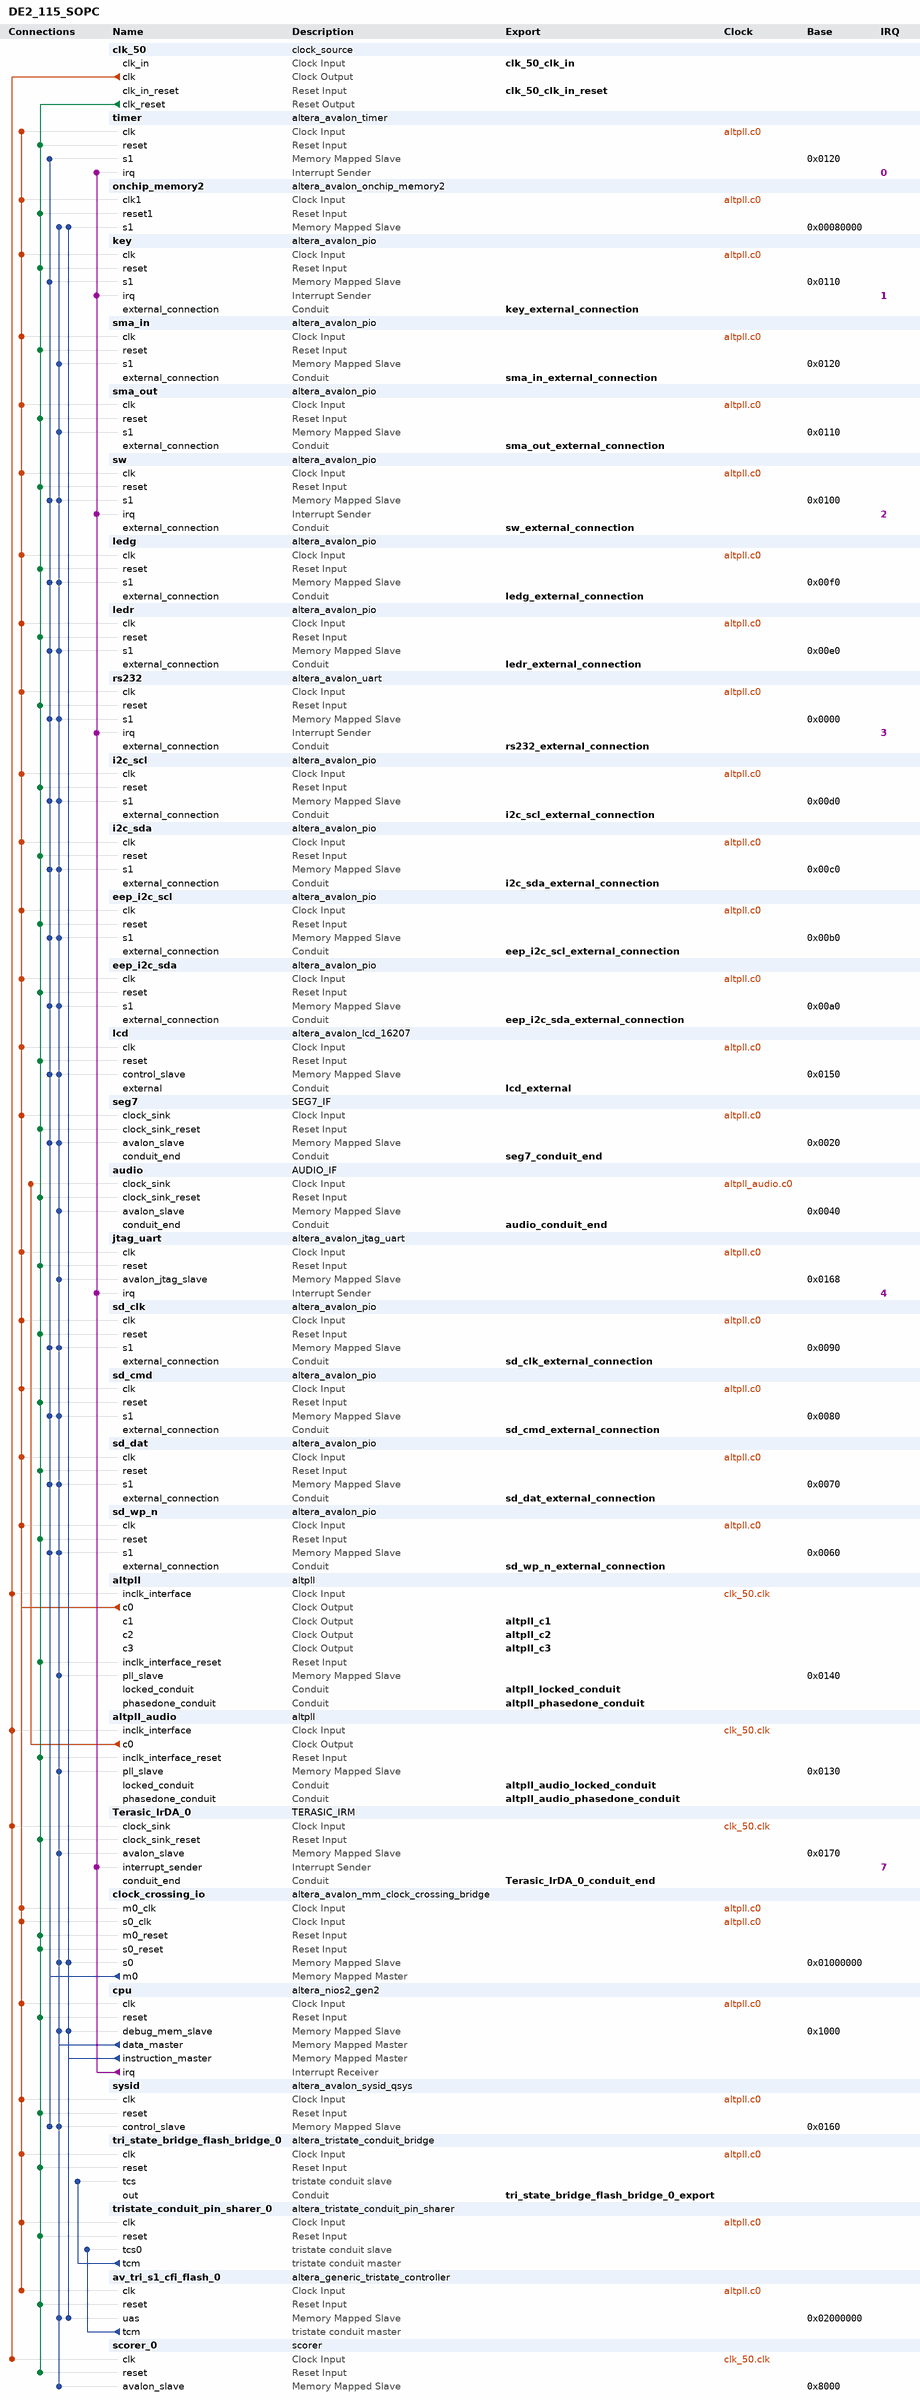
[diagram p0: system contents]
# Platform Designer (Qsys) system DE2_115_SOPC, Cyclone IV E EP4CE115F29C7
# Parameters at their usual value, and those the tool derives, are not listed.
package require -exact qsys 15.0
create_system DE2_115_SOPC
set_project_property DEVICE_FAMILY {Cyclone IV E}
set_project_property DEVICE EP4CE115F29C7

add_instance clk_50 clock_source 15.0
set_instance_parameter_value clk_50 clockFrequency 50000000

add_instance timer altera_avalon_timer 15.0
set_instance_parameter_value timer period 1
set_instance_parameter_value timer periodUnits MSEC

add_instance onchip_memory2 altera_avalon_onchip_memory2 15.0
set_instance_parameter_value onchip_memory2 dataWidth 32
set_instance_parameter_value onchip_memory2 dualPort false
set_instance_parameter_value onchip_memory2 initMemContent true
set_instance_parameter_value onchip_memory2 initializationFileName onchip_memory2
set_instance_parameter_value onchip_memory2 memorySize 262144

add_instance key altera_avalon_pio 15.0
set_instance_parameter_value key captureEdge true
set_instance_parameter_value key direction Input
set_instance_parameter_value key edgeType FALLING
set_instance_parameter_value key generateIRQ true
set_instance_parameter_value key irqType EDGE
set_instance_parameter_value key width 4

add_instance sma_in altera_avalon_pio 15.0
set_instance_parameter_value sma_in direction Input
set_instance_parameter_value sma_in width 1

add_instance sma_out altera_avalon_pio 15.0
set_instance_parameter_value sma_out direction Output
set_instance_parameter_value sma_out width 1

add_instance sw altera_avalon_pio 15.0
set_instance_parameter_value sw captureEdge true
set_instance_parameter_value sw direction Input
set_instance_parameter_value sw edgeType FALLING
set_instance_parameter_value sw generateIRQ true
set_instance_parameter_value sw irqType EDGE
set_instance_parameter_value sw width 18

add_instance ledg altera_avalon_pio 15.0
set_instance_parameter_value ledg direction Output
set_instance_parameter_value ledg width 9

add_instance ledr altera_avalon_pio 15.0
set_instance_parameter_value ledr direction Output
set_instance_parameter_value ledr width 18

add_instance rs232 altera_avalon_uart 15.0
set_instance_parameter_value rs232 baud 115200
set_instance_parameter_value rs232 dataBits 8
set_instance_parameter_value rs232 fixedBaud true
set_instance_parameter_value rs232 parity NONE
set_instance_parameter_value rs232 stopBits 1
set_instance_parameter_value rs232 useCtsRts true

add_instance i2c_scl altera_avalon_pio 15.0
set_instance_parameter_value i2c_scl direction Output
set_instance_parameter_value i2c_scl width 1

add_instance i2c_sda altera_avalon_pio 15.0
set_instance_parameter_value i2c_sda direction Bidir
set_instance_parameter_value i2c_sda width 1

add_instance eep_i2c_scl altera_avalon_pio 15.0
set_instance_parameter_value eep_i2c_scl direction Output
set_instance_parameter_value eep_i2c_scl width 1

add_instance eep_i2c_sda altera_avalon_pio 15.0
set_instance_parameter_value eep_i2c_sda direction Bidir
set_instance_parameter_value eep_i2c_sda width 1

add_instance lcd altera_avalon_lcd_16207 15.0

add_instance seg7 SEG7_IF 1.0
set_instance_parameter_value seg7 SEG7_NUM 8

add_instance audio AUDIO_IF 1.0

add_instance jtag_uart altera_avalon_jtag_uart 15.0
set_instance_parameter_value jtag_uart simInteractiveOptions INTERACTIVE_ASCII_OUTPUT

add_instance sd_clk altera_avalon_pio 15.0
set_instance_parameter_value sd_clk direction Output
set_instance_parameter_value sd_clk width 1

add_instance sd_cmd altera_avalon_pio 15.0
set_instance_parameter_value sd_cmd direction Bidir
set_instance_parameter_value sd_cmd width 1

add_instance sd_dat altera_avalon_pio 15.0
set_instance_parameter_value sd_dat direction Bidir
set_instance_parameter_value sd_dat width 4

add_instance sd_wp_n altera_avalon_pio 15.0
set_instance_parameter_value sd_wp_n direction Input
set_instance_parameter_value sd_wp_n width 1

add_instance altpll altpll 15.0
set_instance_parameter_value altpll CLK0_DIVIDE_BY 1
set_instance_parameter_value altpll CLK0_MULTIPLY_BY 2
set_instance_parameter_value altpll CLK1_DIVIDE_BY 1
set_instance_parameter_value altpll CLK1_DUTY_CYCLE 50
set_instance_parameter_value altpll CLK1_MULTIPLY_BY 2
set_instance_parameter_value altpll CLK1_PHASE_SHIFT -1806
set_instance_parameter_value altpll CLK2_DIVIDE_BY 5
set_instance_parameter_value altpll CLK2_DUTY_CYCLE 50
set_instance_parameter_value altpll CLK2_MULTIPLY_BY 1
set_instance_parameter_value altpll CLK2_PHASE_SHIFT 0
set_instance_parameter_value altpll CLK3_DIVIDE_BY 2
set_instance_parameter_value altpll CLK3_DUTY_CYCLE 50
set_instance_parameter_value altpll CLK3_MULTIPLY_BY 1
set_instance_parameter_value altpll CLK3_PHASE_SHIFT 0
set_instance_parameter_value altpll INCLK0_INPUT_FREQUENCY 20000
set_instance_parameter_value altpll PORT_ARESET PORT_USED
set_instance_parameter_value altpll PORT_LOCKED PORT_USED
set_instance_parameter_value altpll PORT_clk1 PORT_USED
set_instance_parameter_value altpll PORT_clk2 PORT_USED
set_instance_parameter_value altpll PORT_clk3 PORT_USED

add_instance altpll_audio altpll 15.0
set_instance_parameter_value altpll_audio CLK0_DIVIDE_BY 3125
set_instance_parameter_value altpll_audio CLK0_MULTIPLY_BY 1152
set_instance_parameter_value altpll_audio INCLK0_INPUT_FREQUENCY 20000
set_instance_parameter_value altpll_audio PORT_ARESET PORT_USED
set_instance_parameter_value altpll_audio PORT_LOCKED PORT_UNUSED
set_instance_parameter_value altpll_audio PORT_clk1 PORT_UNUSED
set_instance_parameter_value altpll_audio PORT_clk2 PORT_UNUSED
set_instance_parameter_value altpll_audio PORT_clk3 PORT_UNUSED

add_instance Terasic_IrDA_0 TERASIC_IRM 1.0

add_instance clock_crossing_io altera_avalon_mm_clock_crossing_bridge 15.0
set_instance_parameter_value clock_crossing_io ADDRESS_WIDTH 9
set_instance_parameter_value clock_crossing_io COMMAND_FIFO_DEPTH 32
set_instance_parameter_value clock_crossing_io DATA_WIDTH 32
set_instance_parameter_value clock_crossing_io MASTER_SYNC_DEPTH 3
set_instance_parameter_value clock_crossing_io MAX_BURST_SIZE 1
set_instance_parameter_value clock_crossing_io RESPONSE_FIFO_DEPTH 256
set_instance_parameter_value clock_crossing_io SLAVE_SYNC_DEPTH 3
set_instance_parameter_value clock_crossing_io USE_AUTO_ADDRESS_WIDTH 0

add_instance cpu altera_nios2_gen2 15.0
set_instance_parameter_value cpu dcache_size 2048
set_instance_parameter_value cpu exceptionSlave onchip_memory2.s1
set_instance_parameter_value cpu icache_size 4096
set_instance_parameter_value cpu impl Fast
set_instance_parameter_value cpu resetSlave onchip_memory2.s1
set_instance_parameter_value cpu setting_activateTrace true

add_instance sysid altera_avalon_sysid_qsys 15.0
set_instance_parameter_value sysid id 0

add_instance tri_state_bridge_flash_bridge_0 altera_tristate_conduit_bridge 15.0

add_instance tristate_conduit_pin_sharer_0 altera_tristate_conduit_pin_sharer 15.0
set_instance_parameter_value tristate_conduit_pin_sharer_0 NUM_INTERFACES 1

add_instance av_tri_s1_cfi_flash_0 altera_generic_tristate_controller 15.0
set_instance_parameter_value av_tri_s1_cfi_flash_0 ACTIVE_LOW_BEGINTRANSFER 0
set_instance_parameter_value av_tri_s1_cfi_flash_0 ACTIVE_LOW_BYTEENABLE 0
set_instance_parameter_value av_tri_s1_cfi_flash_0 ACTIVE_LOW_OUTPUTENABLE 0
set_instance_parameter_value av_tri_s1_cfi_flash_0 ACTIVE_LOW_READ 1
set_instance_parameter_value av_tri_s1_cfi_flash_0 CHIPSELECT_THROUGH_READLATENCY 0
set_instance_parameter_value av_tri_s1_cfi_flash_0 INTERFACE_ASSIGNMENT_KEYS embeddedsw.configuration.isFlash,embeddedsw.configuration.isMemoryDevice,embeddedsw.configuration.isNonVolatileStorage
set_instance_parameter_value av_tri_s1_cfi_flash_0 INTERFACE_ASSIGNMENT_VALUES 1,1,1
set_instance_parameter_value av_tri_s1_cfi_flash_0 MODULE_ASSIGNMENT_KEYS embeddedsw.configuration.softwareDriver,embeddedsw.CMacro.SETUP_VALUE,embeddedsw.CMacro.WAIT_VALUE,embeddedsw.CMacro.HOLD_VALUE,embeddedsw.CMacro.TIMING_UNITS,embeddedsw.CMacro.SIZE,embeddedsw.memoryInfo.MEM_INIT_DATA_WIDTH,embeddedsw.memoryInfo.HAS_BYTE_LANE,embeddedsw.memoryInfo.IS_FLASH,embeddedsw.memoryInfo.GENERATE_DAT_SYM,embeddedsw.memoryInfo.GENERATE_FLASH,embeddedsw.memoryInfo.DAT_SYM_INSTALL_DIR,embeddedsw.memoryInfo.FLASH_INSTALL_DIR
set_instance_parameter_value av_tri_s1_cfi_flash_0 MODULE_ASSIGNMENT_VALUES {altera_avalon_cfi_flash_driver,60,160,60,"ns",8388608u,8,0,1,1,1,SIM_DIR,APP_DIR}
set_instance_parameter_value av_tri_s1_cfi_flash_0 TCM_ADDRESS_W 23
set_instance_parameter_value av_tri_s1_cfi_flash_0 TCM_BYTEENABLE_W 1
set_instance_parameter_value av_tri_s1_cfi_flash_0 TCM_DATA_HOLD 60
set_instance_parameter_value av_tri_s1_cfi_flash_0 TCM_DATA_W 8
set_instance_parameter_value av_tri_s1_cfi_flash_0 TCM_MAX_PENDING_READ_TRANSACTIONS 3
set_instance_parameter_value av_tri_s1_cfi_flash_0 TCM_READLATENCY 2
set_instance_parameter_value av_tri_s1_cfi_flash_0 TCM_READ_WAIT 160
set_instance_parameter_value av_tri_s1_cfi_flash_0 TCM_SETUP_WAIT 60
set_instance_parameter_value av_tri_s1_cfi_flash_0 TCM_SYMBOLS_PER_WORD 1
set_instance_parameter_value av_tri_s1_cfi_flash_0 TCM_TIMING_UNITS 0
set_instance_parameter_value av_tri_s1_cfi_flash_0 TCM_TURNAROUND_TIME 2
set_instance_parameter_value av_tri_s1_cfi_flash_0 TCM_WRITE_WAIT 160
set_instance_parameter_value av_tri_s1_cfi_flash_0 USE_BEGINTRANSFER 0
set_instance_parameter_value av_tri_s1_cfi_flash_0 USE_BYTEENABLE 0
set_instance_parameter_value av_tri_s1_cfi_flash_0 USE_OUTPUTENABLE 0
set_instance_parameter_value av_tri_s1_cfi_flash_0 USE_READ 1

add_instance scorer_0 scorer 1.0

# connections
add_connection altpll.c0 av_tri_s1_cfi_flash_0.clk clock
add_connection altpll.c0 clock_crossing_io.m0_clk clock
add_connection altpll.c0 clock_crossing_io.s0_clk clock
add_connection altpll.c0 cpu.clk clock
add_connection altpll.c0 eep_i2c_scl.clk clock
add_connection altpll.c0 eep_i2c_sda.clk clock
add_connection altpll.c0 i2c_scl.clk clock
add_connection altpll.c0 i2c_sda.clk clock
add_connection altpll.c0 jtag_uart.clk clock
add_connection altpll.c0 key.clk clock
add_connection altpll.c0 lcd.clk clock
add_connection altpll.c0 ledg.clk clock
add_connection altpll.c0 ledr.clk clock
add_connection altpll.c0 onchip_memory2.clk1 clock
add_connection altpll.c0 rs232.clk clock
add_connection altpll.c0 sd_clk.clk clock
add_connection altpll.c0 sd_cmd.clk clock
add_connection altpll.c0 sd_dat.clk clock
add_connection altpll.c0 sd_wp_n.clk clock
add_connection altpll.c0 seg7.clock_sink clock
add_connection altpll.c0 sma_in.clk clock
add_connection altpll.c0 sma_out.clk clock
add_connection altpll.c0 sw.clk clock
add_connection altpll.c0 sysid.clk clock
add_connection altpll.c0 timer.clk clock
add_connection altpll.c0 tri_state_bridge_flash_bridge_0.clk clock
add_connection altpll.c0 tristate_conduit_pin_sharer_0.clk clock
add_connection altpll_audio.c0 audio.clock_sink clock
add_connection clk_50.clk altpll.inclk_interface clock
add_connection clk_50.clk altpll_audio.inclk_interface clock
add_connection clk_50.clk scorer_0.clk clock
add_connection clk_50.clk Terasic_IrDA_0.clock_sink clock
add_connection clk_50.clk_reset altpll.inclk_interface_reset reset
add_connection clk_50.clk_reset altpll_audio.inclk_interface_reset reset
add_connection clk_50.clk_reset audio.clock_sink_reset reset
add_connection clk_50.clk_reset av_tri_s1_cfi_flash_0.reset reset
add_connection clk_50.clk_reset clock_crossing_io.m0_reset reset
add_connection clk_50.clk_reset clock_crossing_io.s0_reset reset
add_connection clk_50.clk_reset cpu.reset reset
add_connection clk_50.clk_reset eep_i2c_scl.reset reset
add_connection clk_50.clk_reset eep_i2c_sda.reset reset
add_connection clk_50.clk_reset i2c_scl.reset reset
add_connection clk_50.clk_reset i2c_sda.reset reset
add_connection clk_50.clk_reset jtag_uart.reset reset
add_connection clk_50.clk_reset key.reset reset
add_connection clk_50.clk_reset lcd.reset reset
add_connection clk_50.clk_reset ledg.reset reset
add_connection clk_50.clk_reset ledr.reset reset
add_connection clk_50.clk_reset onchip_memory2.reset1 reset
add_connection clk_50.clk_reset rs232.reset reset
add_connection clk_50.clk_reset scorer_0.reset reset
add_connection clk_50.clk_reset sd_clk.reset reset
add_connection clk_50.clk_reset sd_cmd.reset reset
add_connection clk_50.clk_reset sd_dat.reset reset
add_connection clk_50.clk_reset sd_wp_n.reset reset
add_connection clk_50.clk_reset seg7.clock_sink_reset reset
add_connection clk_50.clk_reset sma_in.reset reset
add_connection clk_50.clk_reset sma_out.reset reset
add_connection clk_50.clk_reset sw.reset reset
add_connection clk_50.clk_reset sysid.reset reset
add_connection clk_50.clk_reset Terasic_IrDA_0.clock_sink_reset reset
add_connection clk_50.clk_reset timer.reset reset
add_connection clk_50.clk_reset tri_state_bridge_flash_bridge_0.reset reset
add_connection clk_50.clk_reset tristate_conduit_pin_sharer_0.reset reset
add_connection clock_crossing_io.m0 eep_i2c_scl.s1 avalon
set_connection_parameter_value clock_crossing_io.m0/eep_i2c_scl.s1 baseAddress 0x00b0
add_connection clock_crossing_io.m0 eep_i2c_sda.s1 avalon
set_connection_parameter_value clock_crossing_io.m0/eep_i2c_sda.s1 baseAddress 0x00a0
add_connection clock_crossing_io.m0 i2c_scl.s1 avalon
set_connection_parameter_value clock_crossing_io.m0/i2c_scl.s1 baseAddress 0x00d0
add_connection clock_crossing_io.m0 i2c_sda.s1 avalon
set_connection_parameter_value clock_crossing_io.m0/i2c_sda.s1 baseAddress 0x00c0
add_connection clock_crossing_io.m0 key.s1 avalon
set_connection_parameter_value clock_crossing_io.m0/key.s1 baseAddress 0x0110
add_connection clock_crossing_io.m0 lcd.control_slave avalon
set_connection_parameter_value clock_crossing_io.m0/lcd.control_slave baseAddress 0x0150
add_connection clock_crossing_io.m0 ledg.s1 avalon
set_connection_parameter_value clock_crossing_io.m0/ledg.s1 baseAddress 0x00f0
add_connection clock_crossing_io.m0 ledr.s1 avalon
set_connection_parameter_value clock_crossing_io.m0/ledr.s1 baseAddress 0x00e0
add_connection clock_crossing_io.m0 rs232.s1 avalon
set_connection_parameter_value clock_crossing_io.m0/rs232.s1 baseAddress 0x0000
add_connection clock_crossing_io.m0 sd_clk.s1 avalon
set_connection_parameter_value clock_crossing_io.m0/sd_clk.s1 baseAddress 0x0090
add_connection clock_crossing_io.m0 sd_cmd.s1 avalon
set_connection_parameter_value clock_crossing_io.m0/sd_cmd.s1 baseAddress 0x0080
add_connection clock_crossing_io.m0 sd_dat.s1 avalon
set_connection_parameter_value clock_crossing_io.m0/sd_dat.s1 baseAddress 0x0070
add_connection clock_crossing_io.m0 sd_wp_n.s1 avalon
set_connection_parameter_value clock_crossing_io.m0/sd_wp_n.s1 baseAddress 0x0060
add_connection clock_crossing_io.m0 seg7.avalon_slave avalon
set_connection_parameter_value clock_crossing_io.m0/seg7.avalon_slave baseAddress 0x0020
add_connection clock_crossing_io.m0 sw.s1 avalon
set_connection_parameter_value clock_crossing_io.m0/sw.s1 baseAddress 0x0100
add_connection clock_crossing_io.m0 sysid.control_slave avalon
set_connection_parameter_value clock_crossing_io.m0/sysid.control_slave baseAddress 0x0160
add_connection clock_crossing_io.m0 timer.s1 avalon
set_connection_parameter_value clock_crossing_io.m0/timer.s1 baseAddress 0x0120
add_connection cpu.data_master altpll.pll_slave avalon
set_connection_parameter_value cpu.data_master/altpll.pll_slave baseAddress 0x0140
add_connection cpu.data_master altpll_audio.pll_slave avalon
set_connection_parameter_value cpu.data_master/altpll_audio.pll_slave baseAddress 0x0130
add_connection cpu.data_master audio.avalon_slave avalon
set_connection_parameter_value cpu.data_master/audio.avalon_slave baseAddress 0x0040
add_connection cpu.data_master av_tri_s1_cfi_flash_0.uas avalon
set_connection_parameter_value cpu.data_master/av_tri_s1_cfi_flash_0.uas baseAddress 0x02000000
add_connection cpu.data_master clock_crossing_io.s0 avalon
set_connection_parameter_value cpu.data_master/clock_crossing_io.s0 baseAddress 0x01000000
add_connection cpu.data_master cpu.debug_mem_slave avalon
set_connection_parameter_value cpu.data_master/cpu.debug_mem_slave baseAddress 0x1000
add_connection cpu.data_master eep_i2c_scl.s1 avalon
set_connection_parameter_value cpu.data_master/eep_i2c_scl.s1 baseAddress 0x00b0
add_connection cpu.data_master eep_i2c_sda.s1 avalon
set_connection_parameter_value cpu.data_master/eep_i2c_sda.s1 baseAddress 0x00a0
add_connection cpu.data_master i2c_scl.s1 avalon
set_connection_parameter_value cpu.data_master/i2c_scl.s1 baseAddress 0x00d0
add_connection cpu.data_master i2c_sda.s1 avalon
set_connection_parameter_value cpu.data_master/i2c_sda.s1 baseAddress 0x00c0
add_connection cpu.data_master jtag_uart.avalon_jtag_slave avalon
set_connection_parameter_value cpu.data_master/jtag_uart.avalon_jtag_slave baseAddress 0x0168
add_connection cpu.data_master lcd.control_slave avalon
set_connection_parameter_value cpu.data_master/lcd.control_slave baseAddress 0x0150
add_connection cpu.data_master ledg.s1 avalon
set_connection_parameter_value cpu.data_master/ledg.s1 baseAddress 0x00f0
add_connection cpu.data_master ledr.s1 avalon
set_connection_parameter_value cpu.data_master/ledr.s1 baseAddress 0x00e0
add_connection cpu.data_master onchip_memory2.s1 avalon
set_connection_parameter_value cpu.data_master/onchip_memory2.s1 baseAddress 0x00080000
add_connection cpu.data_master rs232.s1 avalon
set_connection_parameter_value cpu.data_master/rs232.s1 baseAddress 0x0000
add_connection cpu.data_master scorer_0.avalon_slave avalon
set_connection_parameter_value cpu.data_master/scorer_0.avalon_slave baseAddress 0x8000
add_connection cpu.data_master sd_clk.s1 avalon
set_connection_parameter_value cpu.data_master/sd_clk.s1 baseAddress 0x0090
add_connection cpu.data_master sd_cmd.s1 avalon
set_connection_parameter_value cpu.data_master/sd_cmd.s1 baseAddress 0x0080
add_connection cpu.data_master sd_dat.s1 avalon
set_connection_parameter_value cpu.data_master/sd_dat.s1 baseAddress 0x0070
add_connection cpu.data_master sd_wp_n.s1 avalon
set_connection_parameter_value cpu.data_master/sd_wp_n.s1 baseAddress 0x0060
add_connection cpu.data_master seg7.avalon_slave avalon
set_connection_parameter_value cpu.data_master/seg7.avalon_slave baseAddress 0x0020
add_connection cpu.data_master sma_in.s1 avalon
set_connection_parameter_value cpu.data_master/sma_in.s1 baseAddress 0x0120
add_connection cpu.data_master sma_out.s1 avalon
set_connection_parameter_value cpu.data_master/sma_out.s1 baseAddress 0x0110
add_connection cpu.data_master sw.s1 avalon
set_connection_parameter_value cpu.data_master/sw.s1 baseAddress 0x0100
add_connection cpu.data_master sysid.control_slave avalon
set_connection_parameter_value cpu.data_master/sysid.control_slave baseAddress 0x0160
add_connection cpu.data_master Terasic_IrDA_0.avalon_slave avalon
set_connection_parameter_value cpu.data_master/Terasic_IrDA_0.avalon_slave baseAddress 0x0170
add_connection cpu.instruction_master av_tri_s1_cfi_flash_0.uas avalon
set_connection_parameter_value cpu.instruction_master/av_tri_s1_cfi_flash_0.uas baseAddress 0x02000000
add_connection cpu.instruction_master clock_crossing_io.s0 avalon
set_connection_parameter_value cpu.instruction_master/clock_crossing_io.s0 baseAddress 0x01000000
add_connection cpu.instruction_master cpu.debug_mem_slave avalon
set_connection_parameter_value cpu.instruction_master/cpu.debug_mem_slave baseAddress 0x1000
add_connection cpu.instruction_master onchip_memory2.s1 avalon
set_connection_parameter_value cpu.instruction_master/onchip_memory2.s1 baseAddress 0x00080000
add_connection cpu.irq jtag_uart.irq interrupt
set_connection_parameter_value cpu.irq/jtag_uart.irq irqNumber 4
add_connection cpu.irq key.irq interrupt
set_connection_parameter_value cpu.irq/key.irq irqNumber 1
add_connection cpu.irq rs232.irq interrupt
set_connection_parameter_value cpu.irq/rs232.irq irqNumber 3
add_connection cpu.irq sw.irq interrupt
set_connection_parameter_value cpu.irq/sw.irq irqNumber 2
add_connection cpu.irq Terasic_IrDA_0.interrupt_sender interrupt
set_connection_parameter_value cpu.irq/Terasic_IrDA_0.interrupt_sender irqNumber 7
add_connection cpu.irq timer.irq interrupt
set_connection_parameter_value cpu.irq/timer.irq irqNumber 0
add_connection av_tri_s1_cfi_flash_0.tcm tristate_conduit_pin_sharer_0.tcs0 tristate_conduit
add_connection tristate_conduit_pin_sharer_0.tcm tri_state_bridge_flash_bridge_0.tcs tristate_conduit

# exported interfaces
add_interface Terasic_IrDA_0_conduit_end conduit end
set_interface_property Terasic_IrDA_0_conduit_end EXPORT_OF Terasic_IrDA_0.conduit_end
add_interface altpll_audio_locked_conduit conduit end
set_interface_property altpll_audio_locked_conduit EXPORT_OF altpll_audio.locked_conduit
add_interface altpll_audio_phasedone_conduit conduit end
set_interface_property altpll_audio_phasedone_conduit EXPORT_OF altpll_audio.phasedone_conduit
add_interface altpll_c1 clock source
set_interface_property altpll_c1 EXPORT_OF altpll.c1
add_interface altpll_c2 clock source
set_interface_property altpll_c2 EXPORT_OF altpll.c2
add_interface altpll_c3 clock source
set_interface_property altpll_c3 EXPORT_OF altpll.c3
add_interface altpll_locked_conduit conduit end
set_interface_property altpll_locked_conduit EXPORT_OF altpll.locked_conduit
add_interface altpll_phasedone_conduit conduit end
set_interface_property altpll_phasedone_conduit EXPORT_OF altpll.phasedone_conduit
add_interface audio_conduit_end conduit end
set_interface_property audio_conduit_end EXPORT_OF audio.conduit_end
add_interface clk_50_clk_in clock sink
set_interface_property clk_50_clk_in EXPORT_OF clk_50.clk_in
add_interface clk_50_clk_in_reset reset sink
set_interface_property clk_50_clk_in_reset EXPORT_OF clk_50.clk_in_reset
add_interface eep_i2c_scl_external_connection conduit end
set_interface_property eep_i2c_scl_external_connection EXPORT_OF eep_i2c_scl.external_connection
add_interface eep_i2c_sda_external_connection conduit end
set_interface_property eep_i2c_sda_external_connection EXPORT_OF eep_i2c_sda.external_connection
add_interface i2c_scl_external_connection conduit end
set_interface_property i2c_scl_external_connection EXPORT_OF i2c_scl.external_connection
add_interface i2c_sda_external_connection conduit end
set_interface_property i2c_sda_external_connection EXPORT_OF i2c_sda.external_connection
add_interface key_external_connection conduit end
set_interface_property key_external_connection EXPORT_OF key.external_connection
add_interface lcd_external conduit end
set_interface_property lcd_external EXPORT_OF lcd.external
add_interface ledg_external_connection conduit end
set_interface_property ledg_external_connection EXPORT_OF ledg.external_connection
add_interface ledr_external_connection conduit end
set_interface_property ledr_external_connection EXPORT_OF ledr.external_connection
add_interface rs232_external_connection conduit end
set_interface_property rs232_external_connection EXPORT_OF rs232.external_connection
add_interface sd_clk_external_connection conduit end
set_interface_property sd_clk_external_connection EXPORT_OF sd_clk.external_connection
add_interface sd_cmd_external_connection conduit end
set_interface_property sd_cmd_external_connection EXPORT_OF sd_cmd.external_connection
add_interface sd_dat_external_connection conduit end
set_interface_property sd_dat_external_connection EXPORT_OF sd_dat.external_connection
add_interface sd_wp_n_external_connection conduit end
set_interface_property sd_wp_n_external_connection EXPORT_OF sd_wp_n.external_connection
add_interface seg7_conduit_end conduit end
set_interface_property seg7_conduit_end EXPORT_OF seg7.conduit_end
add_interface sma_in_external_connection conduit end
set_interface_property sma_in_external_connection EXPORT_OF sma_in.external_connection
add_interface sma_out_external_connection conduit end
set_interface_property sma_out_external_connection EXPORT_OF sma_out.external_connection
add_interface sw_external_connection conduit end
set_interface_property sw_external_connection EXPORT_OF sw.external_connection
add_interface tri_state_bridge_flash_bridge_0_export conduit end
set_interface_property tri_state_bridge_flash_bridge_0_export EXPORT_OF tri_state_bridge_flash_bridge_0.out

set_interconnect_requirement {$system} qsys_mm.clockCrossingAdapter HANDSHAKE
set_interconnect_requirement {$system} qsys_mm.maxAdditionalLatency 0

save_system DE2_115_SOPC.qsys
